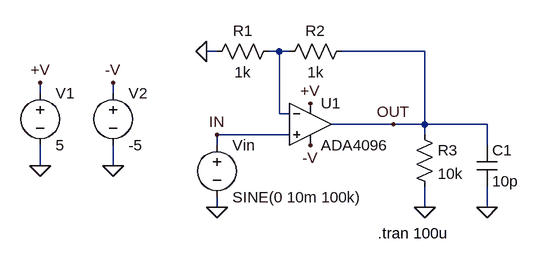
[diagram p0: schematic ADA4096.asc]
ADA4096.asc, the LTspice schematic file:
Version 4
SHEET 1 1240 700
WIRE 432 -1216 416 -1216
WIRE 528 -1216 512 -1216
WIRE 544 -1216 528 -1216
WIRE 752 -1216 624 -1216
WIRE 160 -1152 160 -1168
WIRE 272 -1152 272 -1168
WIRE 528 -1120 528 -1216
WIRE 544 -1120 528 -1120
WIRE 704 -1104 608 -1104
WIRE 752 -1104 752 -1216
WIRE 752 -1104 704 -1104
WIRE 848 -1104 752 -1104
WIRE 544 -1088 432 -1088
WIRE 752 -1088 752 -1104
WIRE 432 -1072 432 -1088
WIRE 848 -1072 848 -1104
WIRE 160 -1040 160 -1072
WIRE 272 -1040 272 -1072
WIRE 432 -976 432 -992
WIRE 752 -976 752 -1008
WIRE 848 -976 848 -1008
FLAG 160 -1168 +V
FLAG 432 -976 0
FLAG 704 -1104 OUT
FLAG 432 -1088 IN
FLAG 576 -1136 +V
FLAG 272 -1168 -V
FLAG 576 -1072 -V
FLAG 416 -1216 0
FLAG 272 -1040 0
FLAG 160 -1040 0
FLAG 752 -976 0
FLAG 848 -976 0
SYMBOL voltage 160 -1168 R0
WINDOW 123 0 0 Left 2
WINDOW 39 0 0 Left 2
SYMATTR InstName V1
SYMATTR Value 5
SYMBOL voltage 432 -1088 R0
WINDOW 123 24 146 Left 2
WINDOW 39 24 125 Left 2
SYMATTR InstName Vin
SYMATTR Value SINE(0 10m 100k)
SYMBOL res 528 -1232 R90
WINDOW 0 0 56 VBottom 2
WINDOW 3 32 56 VTop 2
SYMATTR InstName R1
SYMATTR Value 1k
SYMBOL res 640 -1232 R90
WINDOW 0 0 56 VBottom 2
WINDOW 3 32 56 VTop 2
SYMATTR InstName R2
SYMATTR Value 1k
SYMBOL voltage 272 -1168 R0
WINDOW 123 24 146 Left 2
WINDOW 39 24 125 Left 2
SYMATTR InstName V2
SYMATTR Value -5
SYMBOL res 736 -1104 R0
SYMATTR InstName R3
SYMATTR Value 10k
SYMBOL cap 832 -1072 R0
SYMATTR InstName C1
SYMATTR Value 10p
SYMBOL ADA4096 576 -1168 R0
SYMATTR InstName U1
TEXT 680 -936 Left 2 !.tran 100u

The netlist it stands for:
* ADA4096.asc
V1 +V 0 5
Vin IN 0 SINE(0 10m 100k)
R1 N001 0 1k
R2 OUT N001 1k
V2 -V 0 -5
R3 OUT 0 10k
C1 OUT 0 10p
* U1: ADA4096 (symbol ADA4096 not available, pins judged from their places): In+=IN In-=N001 V+=+V V-=-V OUT=OUT
.tran 100u
.backanno
.end